# Altium schematic sheet Sheet1.SchDoc
size A4
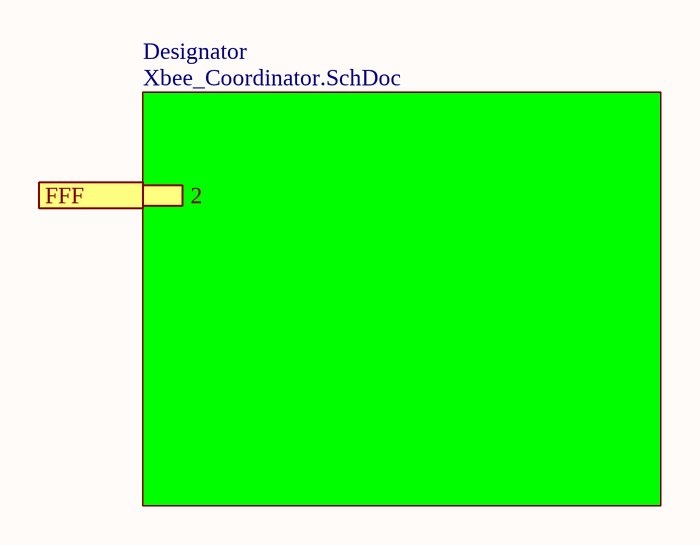
[diagram p0: Sheet1.SchDoc]

## Sub-sheets
Designator = Xbee_Coordinator.SchDoc: 2

## Ports
FFF

## Nets
FFF: port FFF, sheet Designator/2